# EAGLE design 1 (EAGLE 9.4.0)
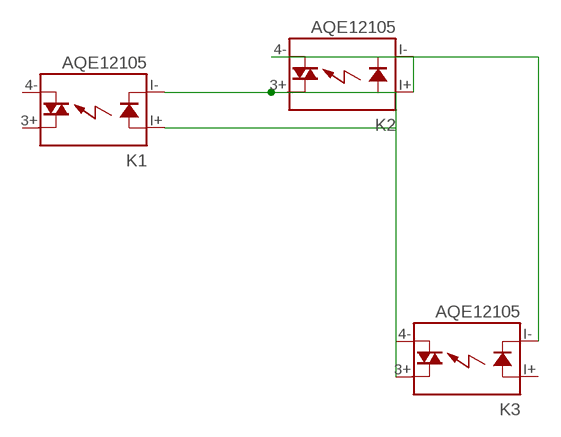
[diagram p0: schematic, sheet 1]

## Parts
K1  AQE12105  [AQE]
K2  AQE12105  [AQE]
K3  AQE12105  [AQE]

## Nets
N$1: K1.I+(A) K3.4-(DS2)
N$2: K1.I-(K) K2.3+(DS1) K3.3+(DS1)
N$3: K2.I+(A) K2.I-(K)
N$4: K2.4-(DS2) K3.I-(K)
Unconnected: K1.3+(DS1) K1.4-(DS2) K3.I+(A)

## Library data of the parts
K1-K3 = relay:AQE*: SOLID STATE RELAY NAiS Source: http://www.mew-europe.com/.. en_ds_61610_0000.pdf; OC_FARNELL: unknown; OC_NEWARK: unknown

## Board
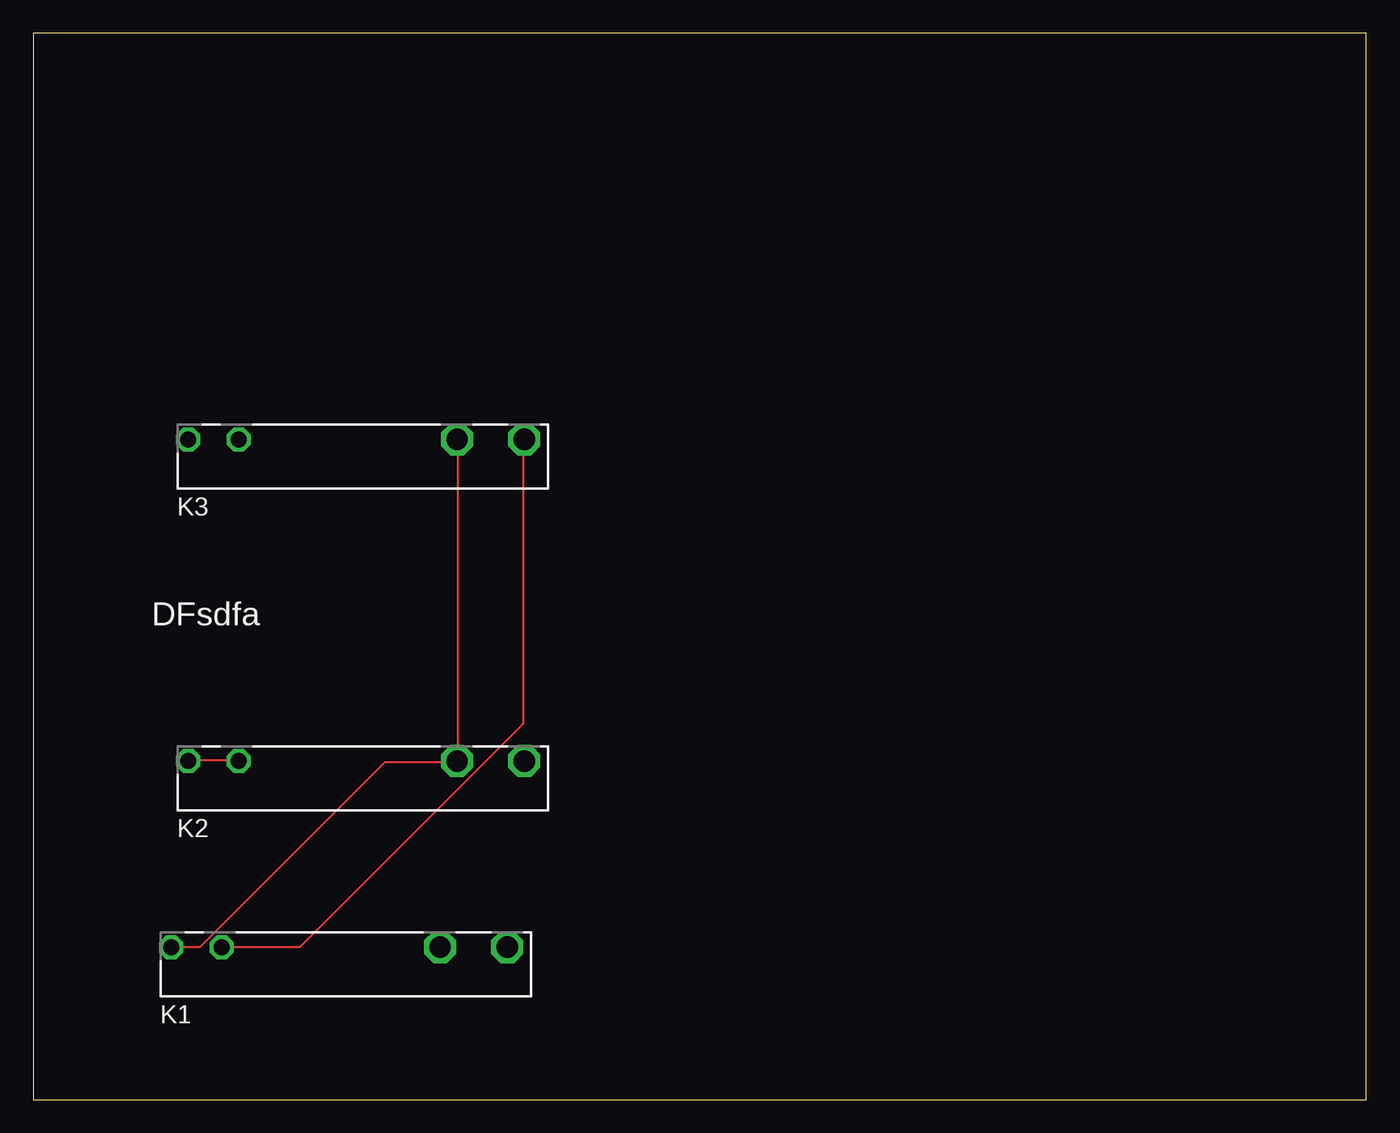
[diagram p1: board, top side]
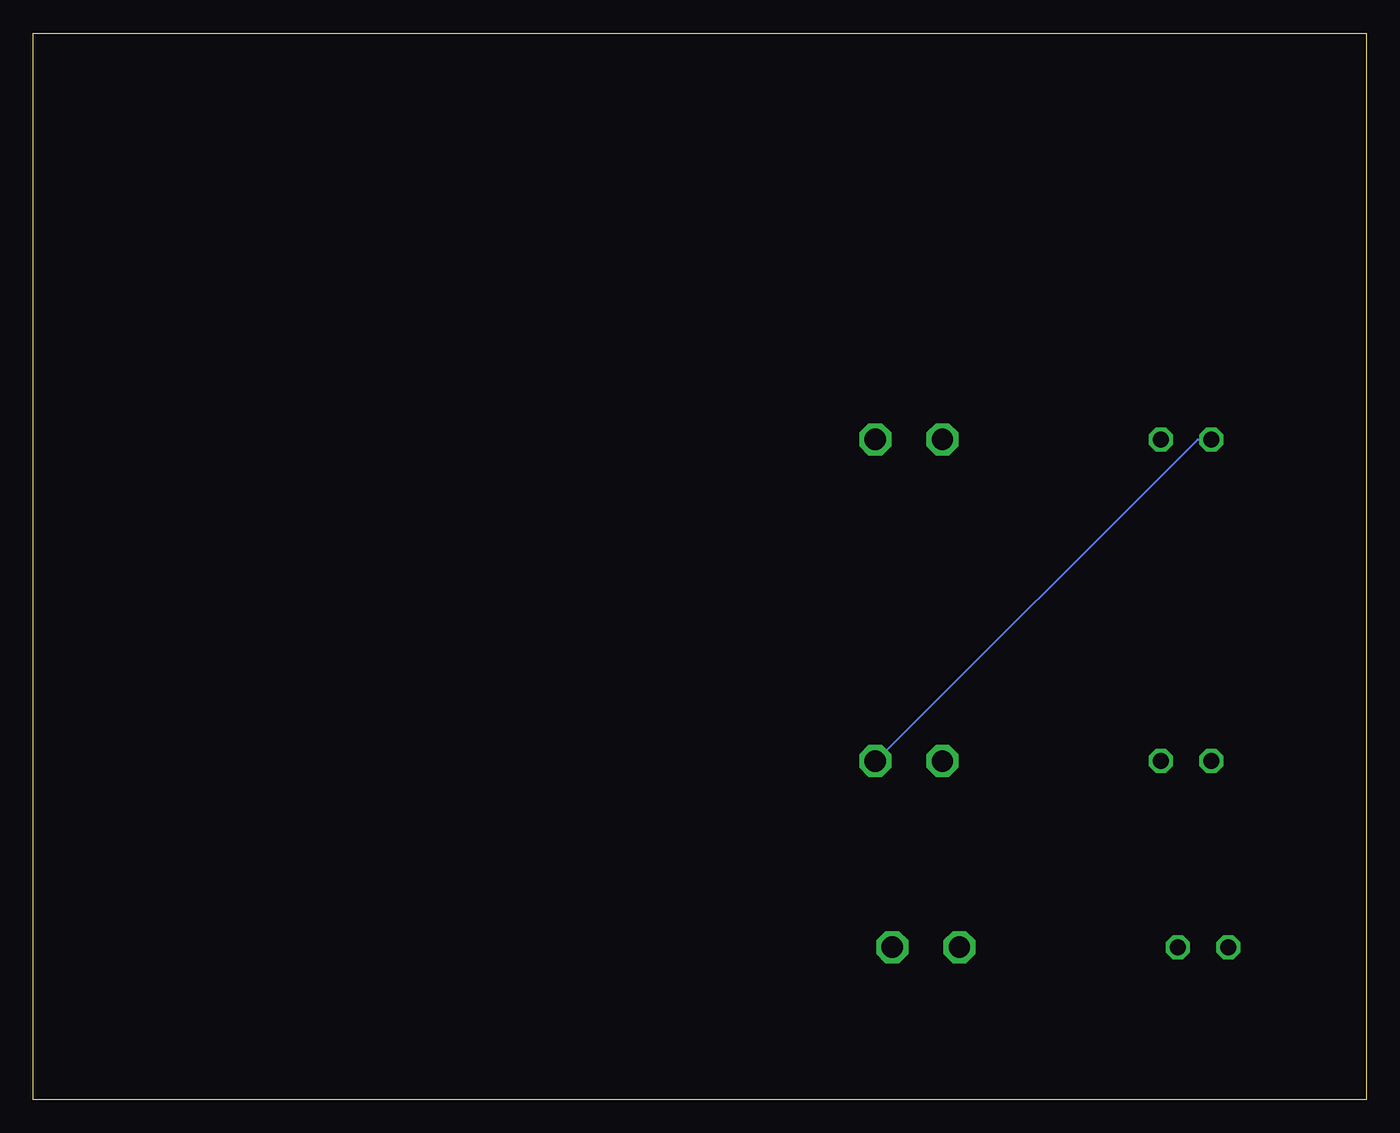
[diagram p2: board, bottom side, seen from below]

Size 100 x 80 mm. Coordinates in mm from the lower left corner, seen from the top.
Outline: 0,0 100,0 100,80 0,80 0,0
Copper layers (1*16): Top 0.035mm / dielectric 1.5mm / Bottom 0.035mm
Design rules "default": minimum track width 6mil, minimum drill 0.35mm, track to track 6mil, track to pad 6mil, pad to pad 6mil, via to via 6mil, smd to smd 6mil, copper to edge 40mil, drill to drill 6mil, minimum pad ring 10mil, minimum via ring 8mil, stop-mask expansion 4mil, vias tented up to drill 0mil, thermal gap 10mil

### Footprints (pad centres in the part's own frame; a part is rotated, then mirrored left to right if it is on the bottom)
AQE = drill 1.6 octagon: 3+ 7.66,1.27; 4- 12.7,1.27 | drill 1.2 octagon: I+ -8.72,1.27; I- -12.5,1.27

### Placement (x,y rotation side)
K1  22.86,10.16 0 top
K2  24.13,24.13 0 top
K3  24.13,48.26 0 top

### Tracks (layer width: path | path; a pad name or v marks a point on that pad's centre or on a via)
N$1
  Top 0.152: K1.I+ 19.96,11.43 36.73,28.19 36.73,49.53 K3.4-
N$2
  Top 0.152: K1.I- 12.5,11.43 26.36,25.3 31.7,25.3 K2.3+ 31.85,25.45 31.85,49.53 K3.3+
N$3
  Top 0.152: K2.I- 11.73,25.45 15.39,25.45 K2.I+
N$4
  Bottom 0.152: K3.I- 12.65,49.53 36.73,25.45 K2.4-

### Text on the board
tPlace: DFsdfa